# Altium schematic sheet FLoRa0.0.SchDoc
size 420 x 297 mm; SheetNumber: 1; SheetTotal: 5; ENG_APP_DATE: --/--/--; DSN_APP_DATE: --/--/--; CHK_APP_DATE: --/--/--; SPICEModelCacheCJHNTGTK: <root> / <DocumentId>CJHNTGTK</DocumentId> / </root>
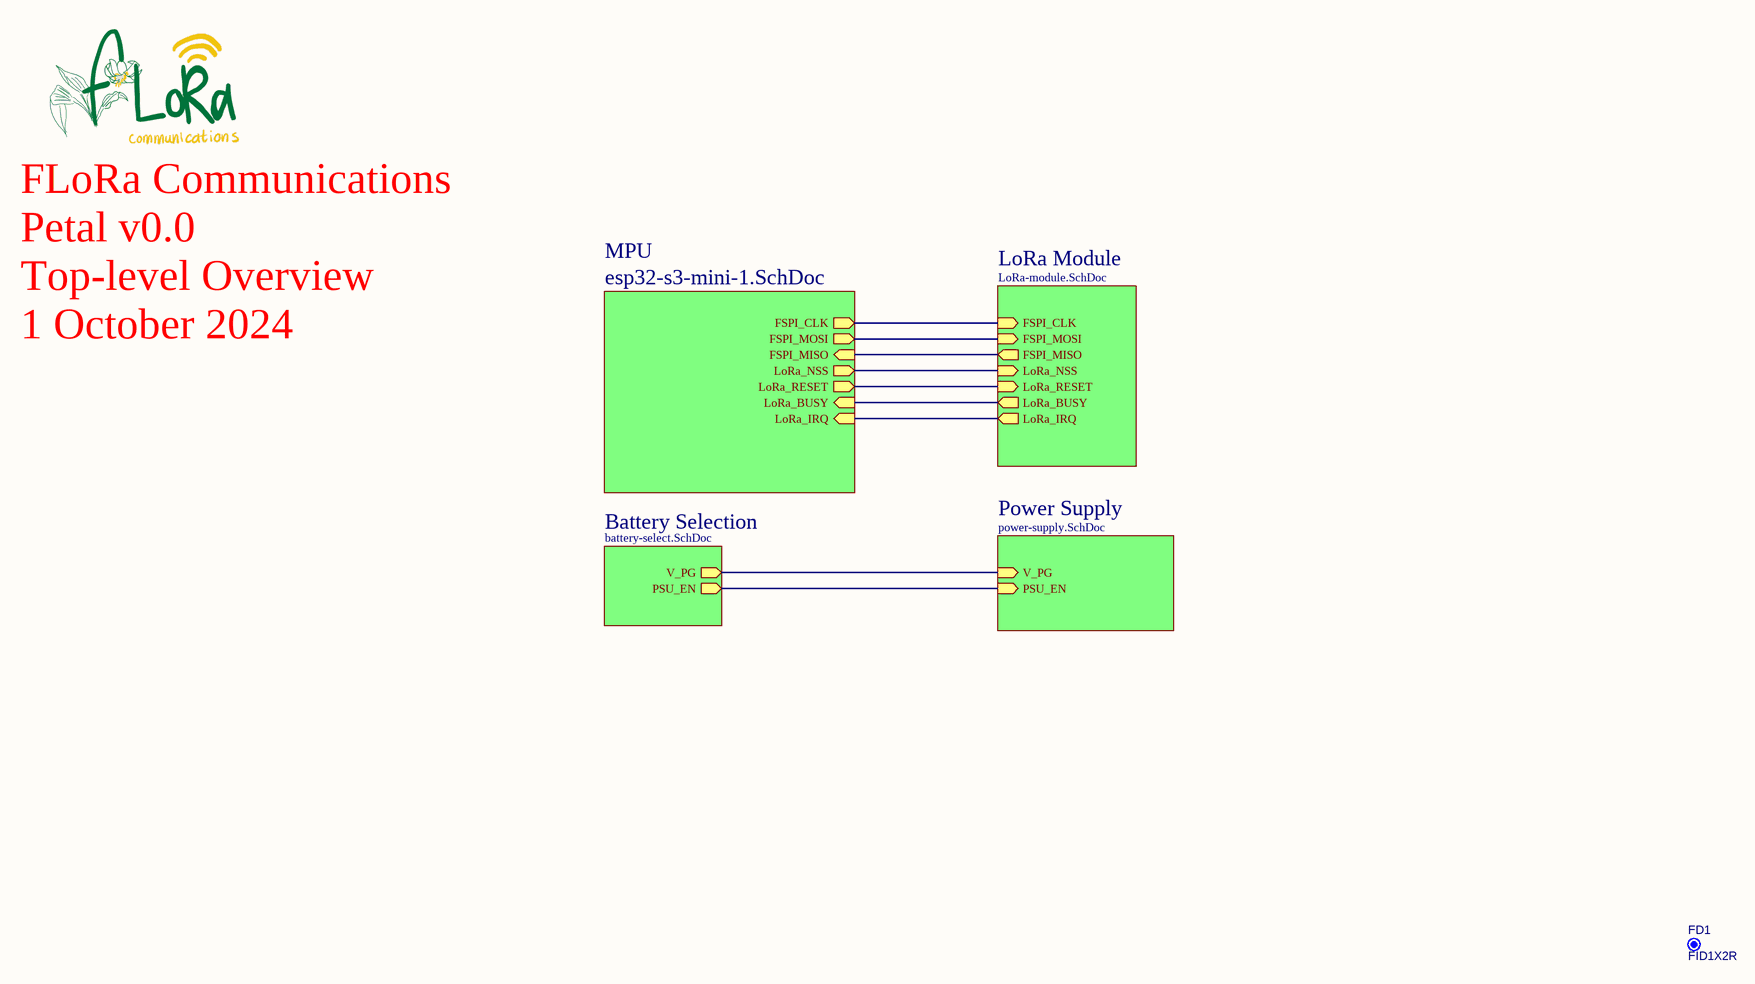
[diagram p0: FLoRa0.0.SchDoc]

## Parts
FD1  FID1X2R  [FID1X2R]  (no BOM)

## Sub-sheets
Battery Selection = battery-select.SchDoc: V_PG (out), PSU_EN (out)
LoRa Module = LoRa-module.SchDoc: FSPI_CLK (in), FSPI_MOSI (in), FSPI_MISO (out), LoRa_NSS (in), LoRa_RESET (in), LoRa_BUSY (out), LoRa_IRQ (out)
MPU = esp32-s3-mini-1.SchDoc: FSPI_CLK (out), FSPI_MISO (in), FSPI_MOSI (out), LoRa_NSS (out), LoRa_RESET (out), LoRa_IRQ (in), LoRa_BUSY (in)
Power Supply = power-supply.SchDoc: PSU_EN (in), V_PG (in)

## Nets
(unnamed): sheet MPU/FSPI_CLK, sheet LoRa Module/FSPI_CLK
(unnamed): sheet MPU/FSPI_MISO, sheet LoRa Module/FSPI_MISO
(unnamed): sheet MPU/FSPI_MOSI, sheet LoRa Module/FSPI_MOSI
(unnamed): sheet MPU/LoRa_NSS, sheet LoRa Module/LoRa_NSS
(unnamed): sheet MPU/LoRa_RESET, sheet LoRa Module/LoRa_RESET
(unnamed): sheet MPU/LoRa_IRQ, sheet LoRa Module/LoRa_IRQ
(unnamed): sheet MPU/LoRa_BUSY, sheet LoRa Module/LoRa_BUSY
(unnamed): sheet Power Supply/PSU_EN, sheet Battery Selection/PSU_EN
(unnamed): sheet Power Supply/V_PG, sheet Battery Selection/V_PG

## Notes on the sheet
- FLoRa Communications
  Petal v0.0
  Top-level Overview
  1 October 2024
- THIS DOCUMENT AND THE DATA DISCLOSED HEREIN OR
- HEREWITH IS THE PROPERTY OF ALTIUM LIMITED AND MAY
- DWG NO:
- REVISION
- REV:
- DESCRIPTION
- DATE
- APPROVED
- BE FREELY DISTRIBUTED IN WHOLE. NO RIGHTS ARE
- RESERVED OR EXPRESS OR IMPLIED WARANTEE GIVEN.
- ENG:
- APPROVALS
- PROJECT
- DSN:
- CHK:
- REFERENCE DOCUMENTS
- PROJECT REVISION:
- TITLE
- DOCUMENT REVISION:
- DESIGN ITEM:
- BOM:
- FAB DWG:
- PCB DWG:
- ASSY DWG:
- SCALE:
- A3
- SIZE
- CAGE CODE
- FILE NAME
- DWG NO.
- SHEET
- OF
- REV

## Library data of the parts
FD1 = CMP-00028-00005-2: Fiducial - Round 1x2mm; Pins: 0